# Altium schematic sheet PP4_pD_GND.SchDoc
size A
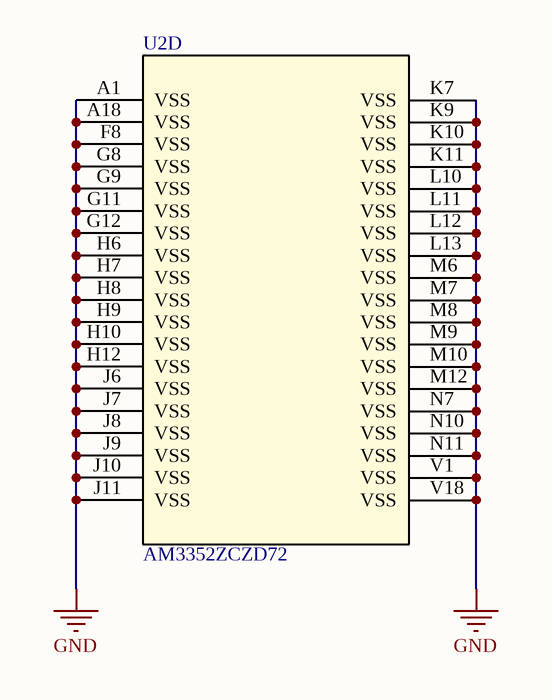
[diagram p0: PP4_pD_GND.SchDoc]

## Parts
U2  AM3352ZCZD72  [ZCZ324]  (part D of 4)

## Nets
GND: U2.A1(VSS) U2.A18(VSS) U2.F8(VSS) U2.G8(VSS) U2.G9(VSS) U2.G11(VSS) U2.G12(VSS) U2.H6(VSS) U2.H7(VSS) U2.H8(VSS) U2.H9(VSS) U2.H10(VSS) U2.H12(VSS) U2.J6(VSS) U2.J7(VSS) U2.J8(VSS) U2.J9(VSS) U2.J10(VSS) U2.J11(VSS) U2.K7(VSS) U2.K9(VSS) U2.K10(VSS) U2.K11(VSS) U2.L10(VSS) U2.L11(VSS) U2.L12(VSS) U2.L13(VSS) U2.M6(VSS) U2.M7(VSS) U2.M8(VSS) U2.M9(VSS) U2.M10(VSS) U2.M12(VSS) U2.N7(VSS) U2.N10(VSS) U2.N11(VSS) U2.V1(VSS) U2.V18(VSS)

## Library data of the parts
U2 = AM3352BZCZD80: Microprocesseur ARM; Fabricant: TEXAS INSTRUMENTS; Fournisseur: Olimex; RefFabricant: AM3352ZCZD72; RefFournisseur: AM3352ZCZD72; DataSheet: http://www.ti.com/lit/ds/symlink/am3352.pdf